# Altium schematic sheet Main schematic.SchDoc
size A4
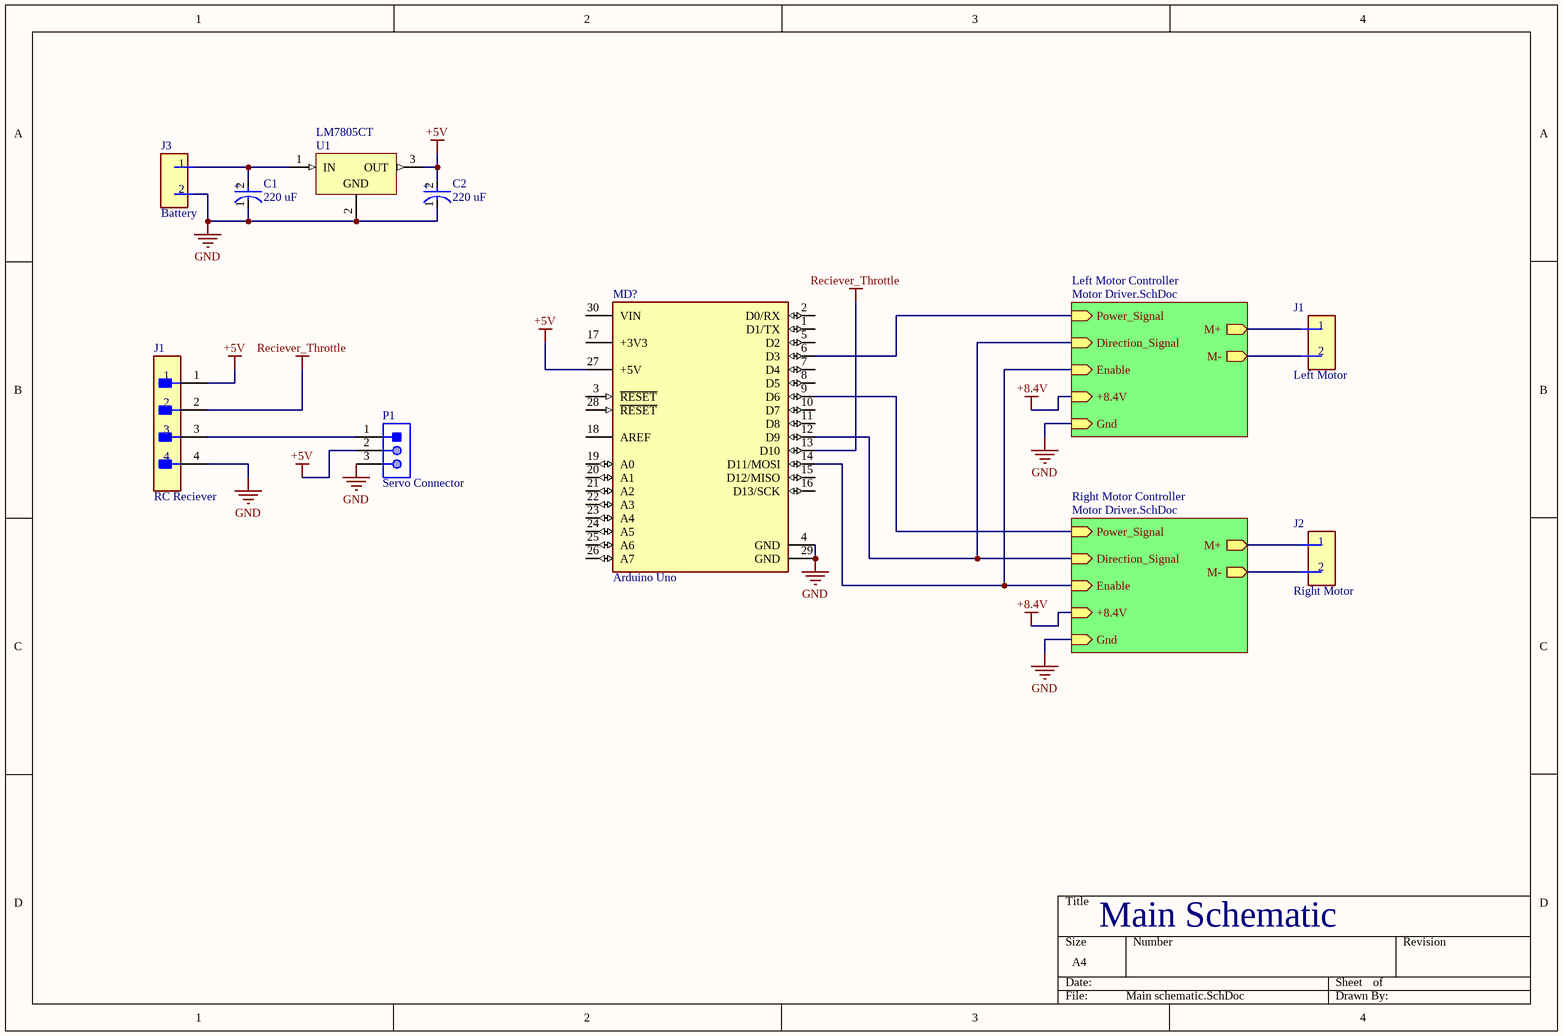
[diagram p0: Main schematic.SchDoc]

## Parts
(Parts that share a designator on the sheet are numbered #1, #2 ... from top to bottom, then left to right.)
C1  220 uF  [FP-RAD-TH-D_8_0_5-L_11_5-MFG]
C2  220 uF  [FP-RAD-TH-D_8_0_5-L_11_5-MFG]
J1#1  Left Motor  [FP-PRT-10474-MFG]
J1#2  RC Reciever  [FP-B4B-XH-A_LF_SN-MFG]
J2  Right Motor  [FP-PRT-10474-MFG]
J3  Battery  [FP-PRT-10474-MFG]
MD?  Arduino Uno  [FP-A000005-MFG]
P1  Servo Connector  [JST-B3B-PH-K-S-3_V]
U1  LM7805CT  [FAIR-TO-220-3]

## Sub-sheets
Left Motor Controller = Motor Driver.SchDoc: Power_Signal (in), Direction_Signal (in), Enable (in), Gnd (in), M+ (out), M- (out), +8.4V (in)
Right Motor Controller = Motor Driver.SchDoc: Power_Signal (in), Direction_Signal (in), Enable (in), Gnd (in), M+ (out), M- (out), +8.4V (in)

## Nets
 +8.4V: sheet Left Motor Controller/+8.4V, sheet Right Motor Controller/+8.4V
+5V: C2.2(A) J1#2.1 MD?.27(+5V) P1.2 U1.3(OUT)
GND: C1.1(C) C2.1(C) J1#2.4 MD?.4(GND) MD?.29(GND) P1.3 U1.2(GND) ; sheet Left Motor Controller/Gnd, sheet Right Motor Controller/Gnd
Reciever_Throttle: J1#2.2 MD?.13(D10)
NetC1_2: C1.2(A) U1.1(IN)
NetJ1#2_3: J1#2.3 P1.1
NetMD?_6: MD?.6(D3) ; sheet Left Motor Controller/Power_Signal
NetMD?_9: MD?.9(D6) ; sheet Right Motor Controller/Power_Signal
NetMD?_12: MD?.12(D9) ; sheet Left Motor Controller/Direction_Signal, sheet Right Motor Controller/Direction_Signal
NetMD?_14: MD?.14(D11/MOSI) ; sheet Left Motor Controller/Enable, sheet Right Motor Controller/Enable

Not connected (* = marked no-connect by the designer): MD? 1(D1/TX) 2(D0/RX) 3(~{RESET}) 5(D2) 7(D4) 8(D5) 10(D7) 11(D8) 15(D12/MISO) 16(D13/SCK) 17(+3V3) 18(AREF) 19(A0) 20(A1) 21(A2) 22(A3) 23(A4) 24(A5) 25(A6) 26(A7) 28(~{RESET}) 30(VIN)

## Notes on the sheet
- Main Schematic
- (in symbol CMP-05427-001200-1) +
- (in symbol CMP-157536-000001-1) 1; 2

## Library data of the parts
C1 C2 = CMP-05427-001200-1: Aluminum Electrolytic Capacitors (Radial Lead Type) AEC-Q200 Qualified 220uF ±20% 25V; Ripple Current (AC): 230mA; Polarity: Polar; Lead Diameter: 0.6mm; Lead/Base Style: Straight; Life (Hours): 1000Hour; Voltage Rating (DC): 25V; Max Operating Temperature: 105°C; Case/Package: Radial; Termination: Radial; Package Quantity: 200; Voltage: 25V; Height: 11.5mm; Capacitance: 220uF; Ripple Current: 230mA; Tolerance: 20%; Mount: Through Hole; Construction: RADIAL; Diameter: 8mm; RoHS Compliant: Yes; Voltage Rating: 25V; Lead Pitch: 3.5mm; Contact Plating: Tin; Height - Seated (Max): 0.512inch; Series: HD; Min Operating Temperature: -55°C; Number of Pins: 2; REACH SVHC: No SVHC; Packaging: Bulk; Length: 11.5mm
J1#1 J2 J3 = CMP-157536-000001-1: XT60 CONNECTORS MALE/FEMALE PAIR
J1#2 = CMP-17439-000250-1: CONN HEADER VERT 4POS 2.5MM; Number of Contacts: 4; Contact Resistance: 20mR; Voltage Rating: 250V; Max Current Rating: 3A; Gender: Male; Wire/Cable Gauge: 22AWG; Mated Stacking Heights: 9.8mm; Insulation Resistance: 1GR; Orientation: Straight; Contact Type: Male Pin; Contact Finish - Mating: TIN; Series: XH; Max Voltage Rating (AC): 250V; Lead Pitch: 2.5mm; Contact Shape: Square; Insulation Color: Natural; Termination: Solder; Lead Free: Lead Free; Voltage Rating (AC): 250V; Number of Rows: 1; Flammability Rating: UL94 V-0; Number of Positions: 4; Max Operating Temperature: 85°C; Package Quantity: 500; Mount: Through Hole; REACH SVHC: No SVHC; Connector Type: Header; Insulation Material: Nylon; Fastening Type: Detent; Min Operating Temperature: -25°C; Housing Color: White; Packaging: Bulk; Contact Plating: Tin; Contact Material: Brass; Max Voltage Rating (DC): 250V; Housing Material: Polyamide; Color: Natural; Material: Polyamide; Pitch: 2.5mm; Depth: 5.75mm; Current Rating: 3A; Length: 12.4mm
MD? = CMP-189986-000002-1: ARDUINO NANO ATMEGA328 EVAL BRD; Number of Bits: 8; Evaluation Kit: Yes; Operating Supply Voltage: 12V; Interface: I2C; Data Bus Width: 8b; Core Architecture: AVR; Packaging: Bulk; Length: 7inch; Package Quantity: 50; Width: 5inch; REACH SVHC: No SVHC; Weight: 0.358383oz; Series: AVR® ATmega; Height: 0.25inch
P1 = CMP-2000-05164-1: Male Header, Pitch 2 mm, 1 x 3 Position, Height 6 mm, Tail Length 3.4 mm, -25 to 85 degC, RoHS, Bulk; Manufacturer: JST; Style/Orientation: StraightHeader/Plug; Pitch: 2mm; No of Positions: 3; Termination: Crimp; Manufacturer URL: http://www.jst.com/home2.html; Datasheet Version: Oct-06; Type: ShroudedHeader; Datasheet URL: https://datasheet.ciiva.com/11746/0900766b80826550-11746939.pdf
U1 = CMP-2000-04938-1: Positive Voltage Regulator, 5 V, 1 A, -40 to 125 degC, 3-Pin TO-220, RoHS, Tube; Manufacturer: FairchildSemiconductor; Maximum Input Voltage: 35V; Maximum Quiescent Current: 8mA; Load Regulation: 100mV; Maximum Output Current: 2.2(Typ)A; Output Type: Fixed; Typical Dropout Voltage @ Current: 2@1AV; Rad Hard: No; Output Voltage: 5V; Accuracy: ±4%; Number of Outputs: 1; Category: LinearRegulator; Package Description: 3-Pin Through Hole Device, Body 10 x 4.5 mm, Pitch 2.54 mm; Packaging: Rail/Tube; Mounting: ThroughHole; Polarity: Positive; Manufacturer URL: https://www.fairchildsemi.com/; Line Regulation: 100mV; Datasheet Version: Aug-12; Datasheet URL: https://datasheet.ciiva.com/26904/lm7805ct-26904988.pdf; Package Reference: TO-220; Package URL: https://www.fairchildsemi.com/package-drawings/TO/TO220B03.pdf; Package: 3TO-220AB; Operating Temperature: -40to125degC; Type: Linear